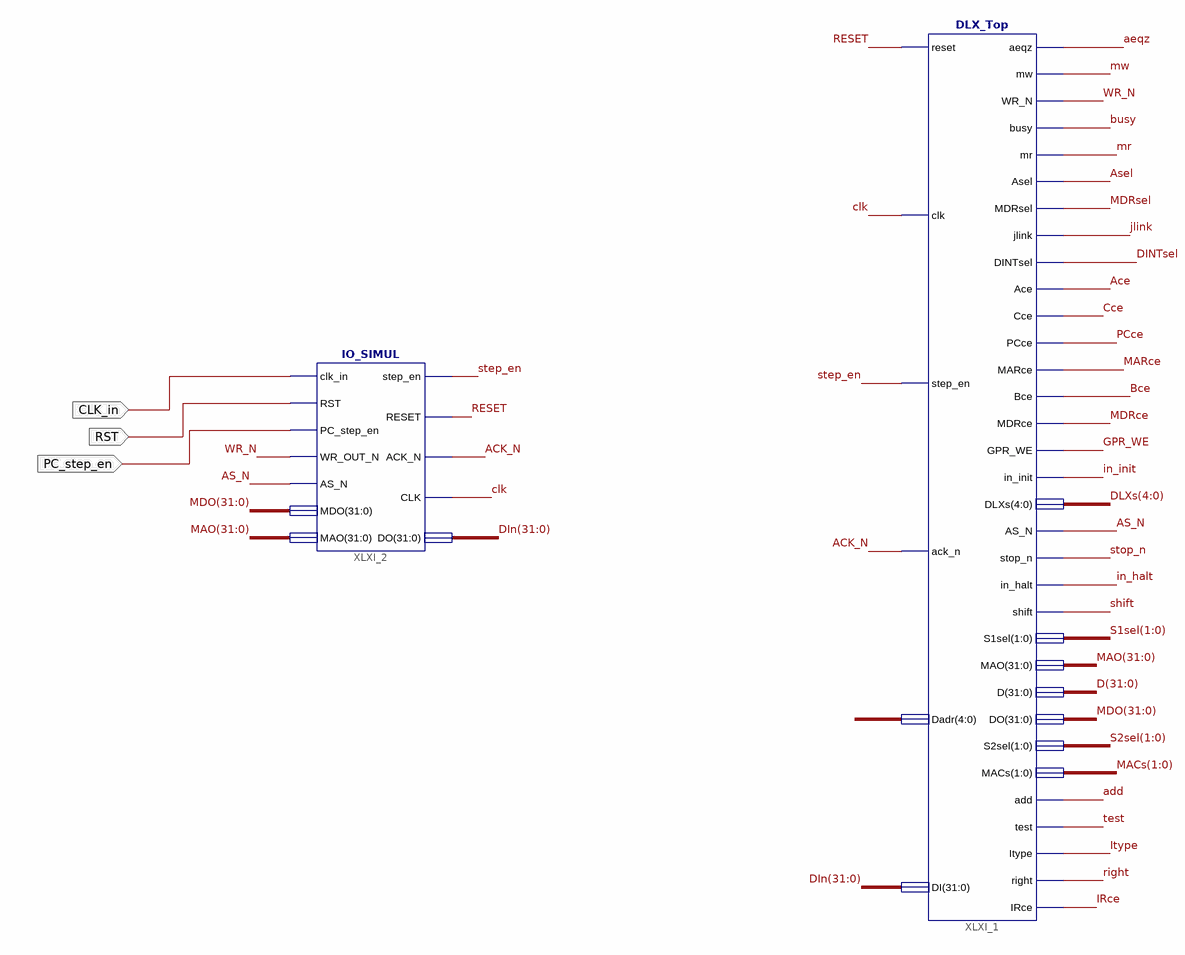
[diagram p0: schematic sheet 1]
// Xilinx ISE schematic DLX_ioSimul.sch (spartan6) as structural Verilog: 2 symbols, 3 ports
module DLX_ioSimul (
  input  CLK_in,
  input  RST,
  input  PC_step_en
);

  wire Ace, ACK_N, add, aeqz, AS_N, Asel, Bce, busy, Cce, clk, DINTsel, GPR_WE, in_halt, in_init, IRce,
       Itype, jlink, MARce, MDRce, MDRsel, mr, mw, PCce, RESET, right, shift, step_en, stop_n, test, WR_N;
  wire [1:0] MACs, S1sel, S2sel;
  wire [4:0] DLXs, XLXN_48;
  wire [31:0] D, DIn, MAO, MDO;

  DLX_Top XLXI_1 (
    .reset(RESET), .clk(clk), .step_en(step_en), .ack_n(ACK_N), .Dadr(XLXN_48), .DI(DIn), .aeqz(aeqz),
    .mw(mw), .WR_N(WR_N), .busy(busy), .mr(mr), .Asel(Asel), .MDRsel(MDRsel), .jlink(jlink),
    .DINTsel(DINTsel), .Ace(Ace), .Cce(Cce), .PCce(PCce), .MARce(MARce), .Bce(Bce), .MDRce(MDRce),
    .GPR_WE(GPR_WE), .in_init(in_init), .DLXs(DLXs), .AS_N(AS_N), .stop_n(stop_n), .in_halt(in_halt),
    .shift(shift), .S1sel(S1sel), .MAO(MAO), .D(D), .DO(MDO), .S2sel(S2sel), .MACs(MACs), .add(add),
    .test(test), .Itype(Itype), .right(right), .IRce(IRce));
  IO_SIMUL XLXI_2 (
    .clk_in(CLK_in), .RST(RST), .PC_step_en(PC_step_en), .WR_OUT_N(WR_N), .AS_N(AS_N), .MDO(MDO), .MAO(MAO),
    .step_en(step_en), .RESET(RESET), .ACK_N(ACK_N), .CLK(clk), .DO(DIn));
endmodule
